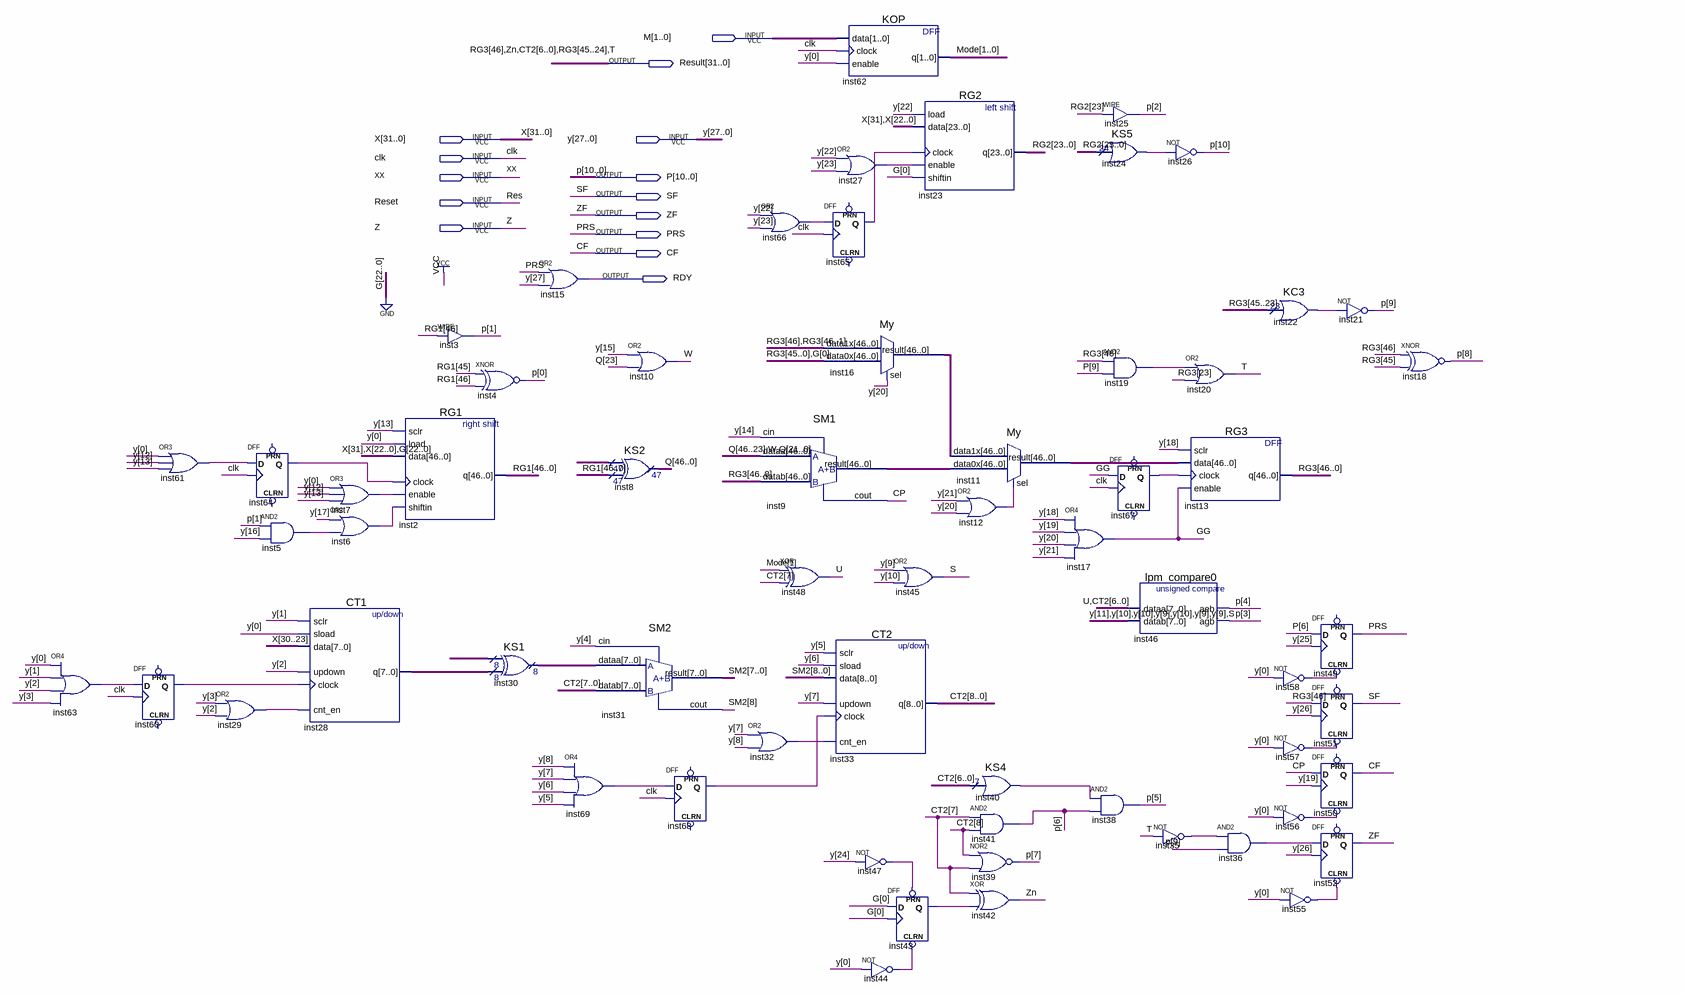
[diagram p0: schematic sheet]
// Quartus schematic Ob.bdf as structural Verilog: 62 symbols, 14 pins
module Ob (
  input  [1:0] M,
  input  [31:0] X,
  input  [27:0] y,
  input  clk,
  input  XX,
  input  Reset,
  input  Z,
  output [31:0] Result,
  output [10:0] P,
  output SF,
  output ZF,
  output PRS,
  output CF,
  output RDY
);

  wire CP, GG, inst5_out, inst6_out, inst7_out, inst12_out, inst19_out, inst22_result, inst24_result,
       inst27_out, inst29_out, inst32_out, inst35_out, inst36_out, inst40_result, inst43_q, inst44_out,
       inst47_out, inst55_out, inst56_out, inst57_out, inst58_out, inst60_q, inst61_out, inst63_out,
       inst64_q, inst65_q, inst66_out, inst67_q, inst68_q, inst69_out, S, U, W;
  wire [1:0] Mode;
  wire [7:0] inst28_q, inst30_result;
  wire [8:0] SM2;
  wire [8:7] CT2;
  wire [23:0] RG2, RG3;
  wire [46:0] inst9_result, inst11_result, inst16_result, Q, RG1;

  or inst63 (inst63_out, y[0], y[1], y[2], y[3]);
  DFF inst60 (.CLK(clk), .D(inst63_out), .Q(inst60_q));  // open: CLRN, PRN
  or inst61 (inst61_out, y[0], y[12], y[13]);
  or inst29 (inst29_out, y[3], y[2]);
  DFF inst64 (.CLK(clk), .D(inst61_out), .Q(inst64_q));  // open: CLRN, PRN
  and inst5 (inst5_out, P[1], y[16]);
  or inst7 (inst7_out, y[0], y[12], y[13]);
  or inst6 (inst6_out, y[17], inst5_out);
  CT1 inst28 (
    .sclr(y[1]), .sload(y[0]), .data(X[30:23]), .updown(y[2]), .clock(inst60_q), .cnt_en(inst29_out),
    .q(inst28_q));
  assign P[1] = RG1[46];  // WIRE inst3
  RG1 inst2 (
    .sclr(y[13]), .load(y[0]), .data({X[31], X[22:0], {23{1'b0}}}), .clock(inst64_q), .enable(inst7_out),
    .shiftin(inst6_out), .q(RG1));
  xnor inst4 (P[0], RG1[45], RG1[46]);
  KS1 inst30 (.data0x({8{y[4]}}), .data1x(inst28_q), .result(inst30_result));
  or inst15 (RDY, PRS, y[27]);
  or inst69 (inst69_out, y[8], y[7], y[6], y[5]);
  or inst10 (W, y[15], Q[23]);
  KS2 inst8 (.data0x({47{y[14]}}), .data1x(RG1), .result(Q));
  SM2 inst31 (.dataa(inst30_result), .datab({CT2[7], Result[29:23]}), .cin(y[4]), .result(SM2[7:0]), .cout(SM2[8]));
  DFF inst68 (.CLK(clk), .D(inst69_out), .Q(inst68_q));  // open: CLRN, PRN
  or inst66 (inst66_out, y[22], y[23]);
  SM1 inst9 (
    .dataa({Q[46:23], W, Q[21:0]}), .datab({Result[31], Result[22:1], RG3}), .cin(y[14]),
    .result(inst9_result), .cout(CP));
  xor inst48 (U, Mode[1], CT2[7]);
  or inst32 (inst32_out, y[7], y[8]);
  KOP inst62 (.data(M), .clock(clk), .enable(y[0]), .q(Mode));
  or inst27 (inst27_out, y[22], y[23]);
  DFF inst65 (.CLK(clk), .D(inst66_out), .Q(inst65_q));  // open: CLRN, PRN
  My inst16 (
    .data1x({{2{Result[31]}}, Result[22:1], RG3[23:1]}), .data0x({Result[22:1], RG3, 1'b0}), .sel(y[20]),
    .result(inst16_result));
  CT2 inst33 (
    .sclr(y[5]), .sload(y[6]), .data(SM2), .updown(y[7]), .clock(inst68_q), .cnt_en(inst32_out),
    .q({CT2, Result[29:23]}));
  or inst45 (S, y[9], y[10]);
  not inst47 (inst47_out, y[24]);
  DFF inst43 (.CLRN(inst44_out), .CLK(1'b0), .D(1'b0), .PRN(inst47_out), .Q(inst43_q));
  not inst44 (inst44_out, y[0]);
  RG2 inst23 (.load(y[22]), .data({X[31], X[22:0]}), .clock(inst65_q), .enable(inst27_out), .shiftin(1'b0), .q(RG2));
  My inst11 (.data1x(inst16_result), .data0x(inst9_result), .sel(inst12_out), .result(inst11_result));
  or inst12 (inst12_out, y[21], y[20]);
  KS4 inst40 (.data(Result[29:23]), .result(inst40_result));
  and inst41 (P[6], CT2[7], CT2[8]);
  nor inst39 (P[7], CT2[8], CT2[7]);
  xor inst42 (Result[30], CT2[7], inst43_q);
  KS5 inst24 (.data(RG2), .result(inst24_result));
  or inst17 (GG, y[18], y[19], y[20], y[21]);
  and inst38 (P[5], inst40_result, P[6]);
  assign P[2] = RG2[23];  // WIRE inst25
  and inst19 (inst19_out, Result[31], P[9]);
  DFF inst67 (.CLK(clk), .D(GG), .Q(inst67_q));  // open: CLRN, PRN
  lpm_compare0 inst46 (
    .dataa({U, Result[29:23]}), .datab({y[11:10], y[10:9], y[10:9], y[9], S}), .aeb(P[4]), .agb(P[3]));
  not inst26 (P[10], inst24_result);
  or inst20 (Result[0], inst19_out, RG3[23]);
  RG3 inst13 (.sclr(y[18]), .data(inst11_result), .clock(inst67_q), .enable(GG), .q({Result[31], Result[22:1], RG3}));
  not inst35 (inst35_out, Result[0]);
  and inst36 (inst36_out, inst35_out, P[9]);
  KC3 inst22 (.data({Result[22:1], RG3[23]}), .result(inst22_result));
  not inst58 (inst58_out, y[0]);
  not inst57 (inst57_out, y[0]);
  not inst56 (inst56_out, y[0]);
  not inst55 (inst55_out, y[0]);
  not inst21 (P[9], inst22_result);
  DFF inst49 (.CLRN(inst58_out), .CLK(y[25]), .D(P[6]), .Q(PRS));  // open: PRN
  DFF inst51 (.CLRN(inst57_out), .CLK(y[26]), .D(Result[31]), .Q(SF));  // open: PRN
  DFF inst50 (.CLRN(inst56_out), .CLK(y[19]), .D(CP), .Q(CF));  // open: PRN
  DFF inst52 (.CLRN(inst55_out), .CLK(y[26]), .D(inst36_out), .Q(ZF));  // open: PRN
  xnor inst18 (P[8], Result[31], Result[22]);

  // Other names for the same wires on the sheet: CT2[6:0] = Result[29:23]; Res = Reset;
  //   RG3[46:24] = {Result[31], Result[22:1]}; T = Result[0]; Zn = Result[30]
endmodule
